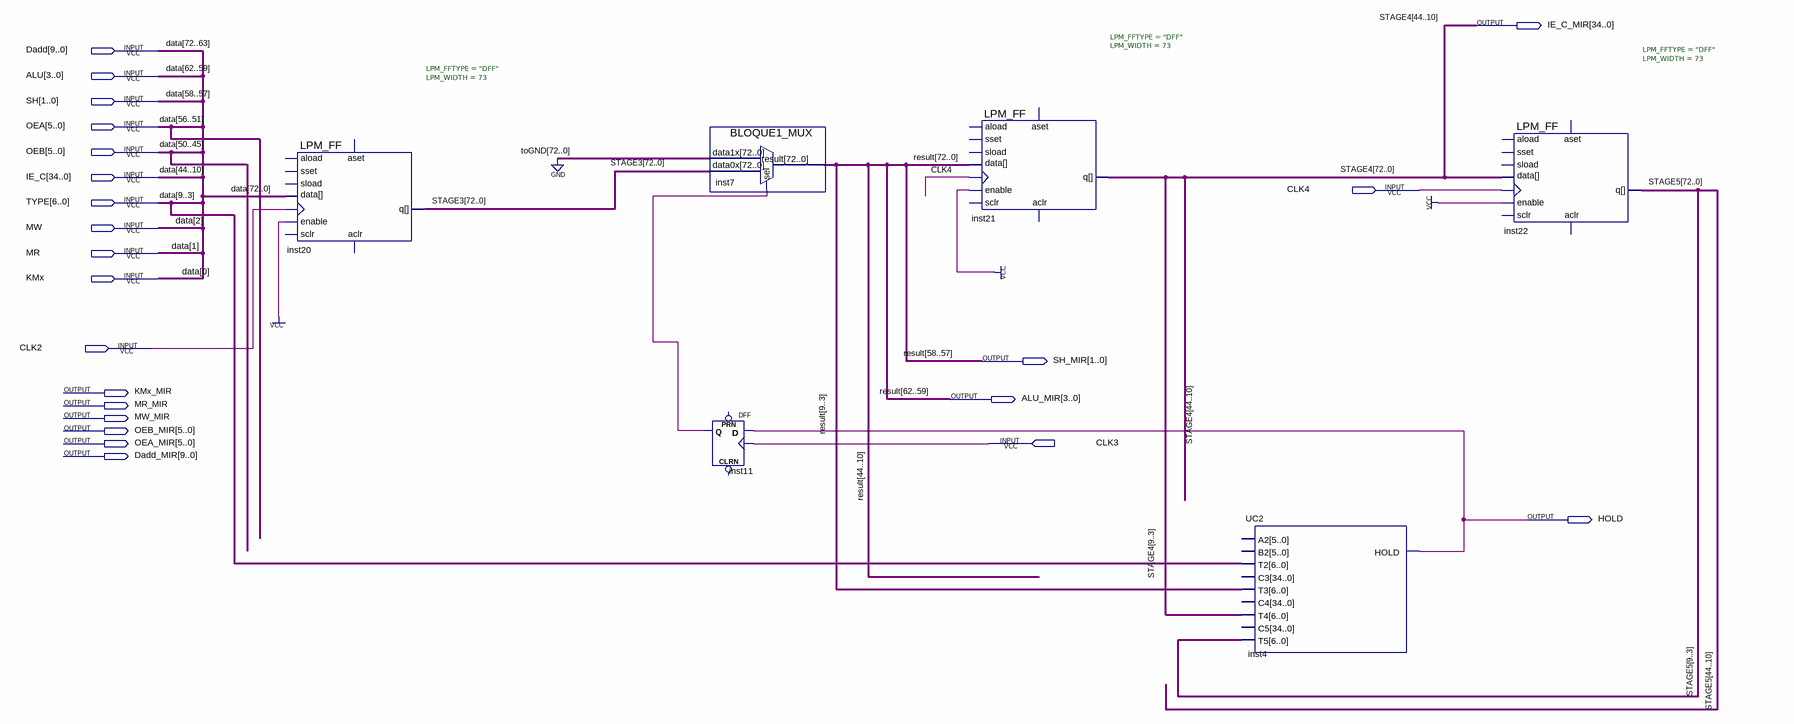
[diagram p0: schematic sheet]
// Quartus schematic Pipeline.bdf as structural Verilog: 6 symbols, 23 pins
module Pipeline (
  input  [9:0] Dadd,
  input  [3:0] ALU,
  input  [1:0] SH,
  input  [5:0] OEA,
  input  [5:0] OEB,
  input  [34:0] IE_C,
  input  CLK4,
  input  [6:0] TYPE,
  input  MW,
  input  MR,
  input  KMx,
  input  CLK2,
  input  CLK3,
  output [34:0] IE_C_MIR,
  output [1:0] SH_MIR,
  output KMx_MIR,
  output [3:0] ALU_MIR,
  output MR_MIR,
  output MW_MIR,
  output [5:0] OEB_MIR,
  output [5:0] OEA_MIR,
  output [9:0] Dadd_MIR,
  output HOLD
);

  wire inst11_q;
  wire [72:0] result, STAGE3, STAGE4, STAGE5;

  LPM_FF #(.LPM_FFTYPE("DFF"), .LPM_WIDTH(73)) inst20 (
    .enable(1'b1), .clock(CLK2), .data({Dadd, ALU, SH, OEA, OEB, IE_C, TYPE, MW, MR, KMx}), .q(STAGE3));  // open: aload, sset, sload, aset, sclr, aclr
  BLOQUE1_MUX inst7 (
    .data1x({73{1'b0}}), .data0x(STAGE3), .sel(inst11_q),
    .result({result[72:63], ALU_MIR, SH_MIR, result[56:0]}));
  DFF inst11 (.CLK(CLK3), .D(HOLD), .Q(inst11_q));  // open: CLRN, PRN
  LPM_FF #(.LPM_FFTYPE("DFF"), .LPM_WIDTH(73)) inst21 (
    .enable(1'b1), .clock(CLK4), .data({result[72:63], ALU_MIR, SH_MIR, result[56:0]}),
    .q({STAGE4[72:45], IE_C_MIR, STAGE4[9:0]}));  // open: aload, sset, sload, aset, sclr, aclr
  UC2 inst4 (.T2(TYPE), .T3(result[9:3]), .T5(STAGE5[9:3]), .T4(STAGE4[9:3]), .HOLD(HOLD));  // open: C5, B2, C4, A2, C3
  LPM_FF #(.LPM_FFTYPE("DFF"), .LPM_WIDTH(73)) inst22 (
    .enable(1'b1), .clock(CLK4), .data({STAGE4[72:45], IE_C_MIR, STAGE4[9:0]}), .q(STAGE5));  // open: aload, sset, sload, aset, sclr, aclr

  // Other names for the same wires on the sheet: data[72:0] = {Dadd, ALU, SH, OEA, OEB, IE_C, TYPE, MW, MR, KMx};
  //   result[62:57] = {ALU_MIR, SH_MIR}; STAGE4[44:10] = IE_C_MIR
endmodule
